# Altium project AC-DC Power supply.PrjPcb
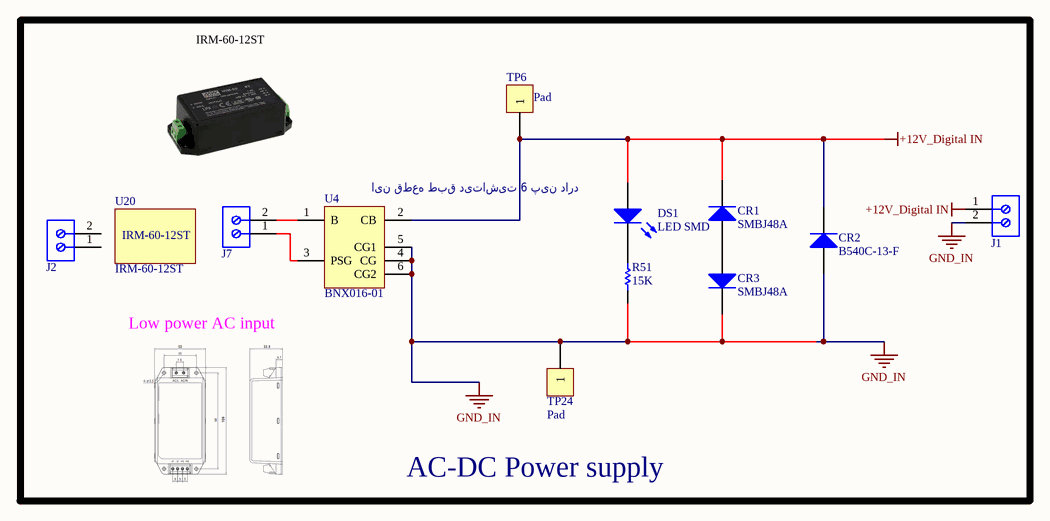
[diagram p0: AC-DC Power supply.SchDoc]
1 sheet, 12 parts. Net scope: global (net labels, ports and power ports of the same name join across sheets).
Board file: AC-DC Power supply-V1.0.PcbDoc

## Sheet AC-DC Power supply.SchDoc
size A

### Parts
CR1  SMBJ48A  [SMB (DO-214AA)]
CR2  B540C-13-F  [SMC (DO-214AB)]
CR3  SMBJ48A  [SMB (DO-214AA)]
DS1  LED SMD  [LED0805]
J1  691101710002  [691101710002]  (value not drawn)
J2  691101710002  [691101710002]  (value not drawn)
J7  691101710002  [691101710002]  (value not drawn)
R51  15K  [R0805]
TP6  Pad  [TP-0.5mm]
TP24  Pad  [TP-0.5mm]
U4  BNX016-01  [BNX016]
U20  IRM-60-12ST  [IRM-60-12ST]

### Nets
+12V_Digital IN: CR1.2(K) CR2.K DS1.1(A) J1.1 TP6.1 U4.2(CB)
GND_IN: CR2.A CR3.2(K) J1.2 R51.2 TP24.1 U4.4(CG) U4.5 U4.6
NetCR1_1: CR1.1(A) CR3.1(A)
NetDS1_2: DS1.2(K) R51.1
NetJ7_1: J7.1 U4.3(PSG)
NetJ7_2: J7.2 U4.1(B)

Not connected (* = marked no-connect by the designer): J2 1 2; U20 5 6

### Notes on the sheet
- IRM-60-12ST
- (near U4) این قطعه طبق دیتاشیت 6 پین دارد
- (near U4) Low power AC input
- AC-DC Power supply

### Library data of the parts
CR1 CR3 = DiodeSMD4.5mm
CR2 = DiodeSMD5.5mm
J1 J2 J7 = 691101710002: WR-TBL Series 101 Horizontal Entry Modular, THT, pitch 5mm, 2p; Manufacturer: Wurth Elektronik; Modularity: Yes; Rated Current: 16A; Working Voltage: 250V; ComponentLink1Description: Website Link; ComponentLink1URL: https://www.we-online.com/redexpert/article/691101710002?ad; ComponentLink2Description: Datasheet Link; ComponentLink2URL: https://www.we-online.com/redexpert/spec/691101710002?ad; Manufacturer Part Number: 691101710002; Category: Terminal Blocks; Match Code: WR-TBL; Mount: Through Hole; Operating Temperature Max: 105°C; Operating Temperature Min: -40°C; Packaging: Box; Application: Pressure Clamp; Number of Pins: 2; Number of Rows: 1; Orientation: Horizontal; Pitch: 5mm
R51 = ResSMD
TP6 TP24 = Con1 pin-Small
U4 = BNX016